# Altium schematic sheet 18_PWR_INPUT.SchDoc
size A3; DocumentNumber: 18; SheetNumber: 18; SheetTotal: 21
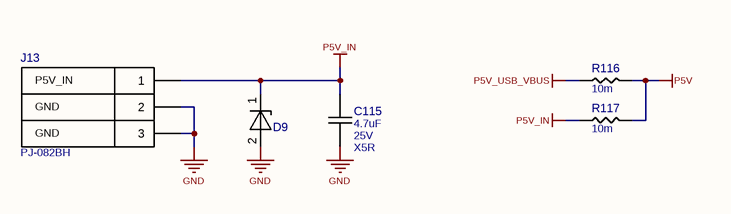
[diagram p0: 18_PWR_INPUT.SchDoc]

## Parts
C115  4.7uF  Voltage: 25V  TempC: X5R  [CAPC1608X08N]
D9  ESD401DPYR  [DFN65P100X50-2N]  (value not drawn)
J13  PJ-082BH  [CUI_PJ-082BH]
R116  10m  [RESC2012X06N]
R117  10m  [RESC2012X06N]

## Nets
GND: C115.1 D9.2(A) J13.2 J13.3
P5V: R116.2 R117.2
P5V_IN: C115.2 D9.1(C) J13.1 R117.1
P5V_USB_VBUS: R116.1

## Notes on the sheet
- P5V_IN
- GND

## Library data of the parts
C115 = GRM188R61E475KE11D: CAP CER 4.7UF 25V X5R 0603; Manufacturer 1: Murata Electronics; Tol: 10%; Part Number: GRM188R61E475KE11D; Value: 4.7uF; Manufacturer Part Number 1: GRM188R61E475KE11D; Supplier 1: Digi-Key; Supplier Part Number 1: 490-7203-1-ND
D9 = ESD401DPYR: TVS DIODE 5.5V 24V 2X1SON; Manufacturer 1: Texas Instruments; Part Number: ESD401DPYR; Manufacturer Part Number 1: ESD401DPYR; Supplier 1: Digi-Key; Supplier Part Number 1: 296-47160-1-ND
J13 = PJ-082BH: CONN PWR JACK 2.5X5.5MM SOLDER; Manufacturer 1: CUI Devices; Part Number: PJ-082BH; Manufacturer Part Number 1: PJ-082BH; Supplier 1: Digi-Key; Supplier Part Number 1: CP-082BHTR-ND
R116 R117 = PF0805FRM7W0R01L: RES 0.01 OHM 1% 1/4W 0805; Manufacturer 1: Yageo; Part Number: PF0805FRM7W0R01L; Value: 10m; Tol: 1%; Manufacturer Part Number 1: PF0805FRM7W0R01L; Supplier 1: Digi-Key; Supplier Part Number 1: 311-0.01NUCT-ND